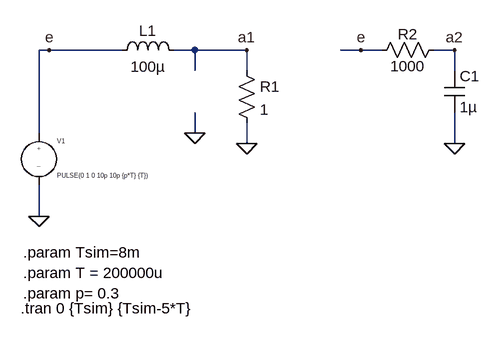
[diagram p0: schematic Draft1.asc]
Draft1.asc, the LTspice schematic file:
Version 4
SHEET 1 880 680
WIRE -480 -160 -496 -160
WIRE -368 -160 -480 -160
WIRE -256 -160 -288 -160
WIRE -176 -160 -256 -160
WIRE 0 -160 -32 -160
WIRE 32 -160 0 -160
WIRE 144 -160 112 -160
WIRE -256 -128 -256 -160
WIRE -176 -128 -176 -160
WIRE 144 -128 144 -160
WIRE -496 -32 -496 -160
WIRE -256 -32 -256 -64
WIRE -176 -16 -176 -48
WIRE 144 -16 144 -64
WIRE -496 96 -496 48
FLAG -256 -32 0
FLAG -496 96 0
FLAG -176 -16 0
FLAG -480 -160 e
FLAG -176 -160 a1
FLAG 144 -16 0
FLAG 0 -160 e
FLAG 144 -160 a2
SYMBOL MDB_sym\\source-V -496 -48 R0
WINDOW 123 0 0 Left 2
WINDOW 39 0 0 Left 2
SYMATTR InstName V1
SYMATTR Value PULSE(0 1 0 10p 10p {p*T} {T})
SYMBOL ind -384 -144 R270
WINDOW 0 30 56 VTop 2
WINDOW 3 6 56 VBottom 2
SYMATTR InstName L1
SYMATTR Value 100µ
SYMBOL res -192 -144 R0
SYMATTR InstName R1
SYMATTR Value 1
SYMBOL res 16 -144 R270
WINDOW 0 25 56 VTop 2
WINDOW 3 7 56 VBottom 2
SYMATTR InstName R2
SYMATTR Value 1000
SYMBOL cap 128 -128 R0
SYMATTR InstName C1
SYMATTR Value 1µ
TEXT -520 152 Left 2 !.param Tsim=8m\n.param T = 200000u\n.param p= 0.3
TEXT -524 238 Left 2 !.tran 0 {Tsim} {Tsim-5*T}

The netlist it stands for:
* Draft1.asc
V1 e 0 PULSE(0 1 0 10p 10p {p*T} {T})
L1 e a1 100µ
R1 a1 0 1
R2 e a2 1000
C1 a2 0 1µ
.param Tsim=8m
.param T = 200000u
.param p= 0.3
.tran 0 {Tsim} {Tsim-5*T}
.backanno
.end